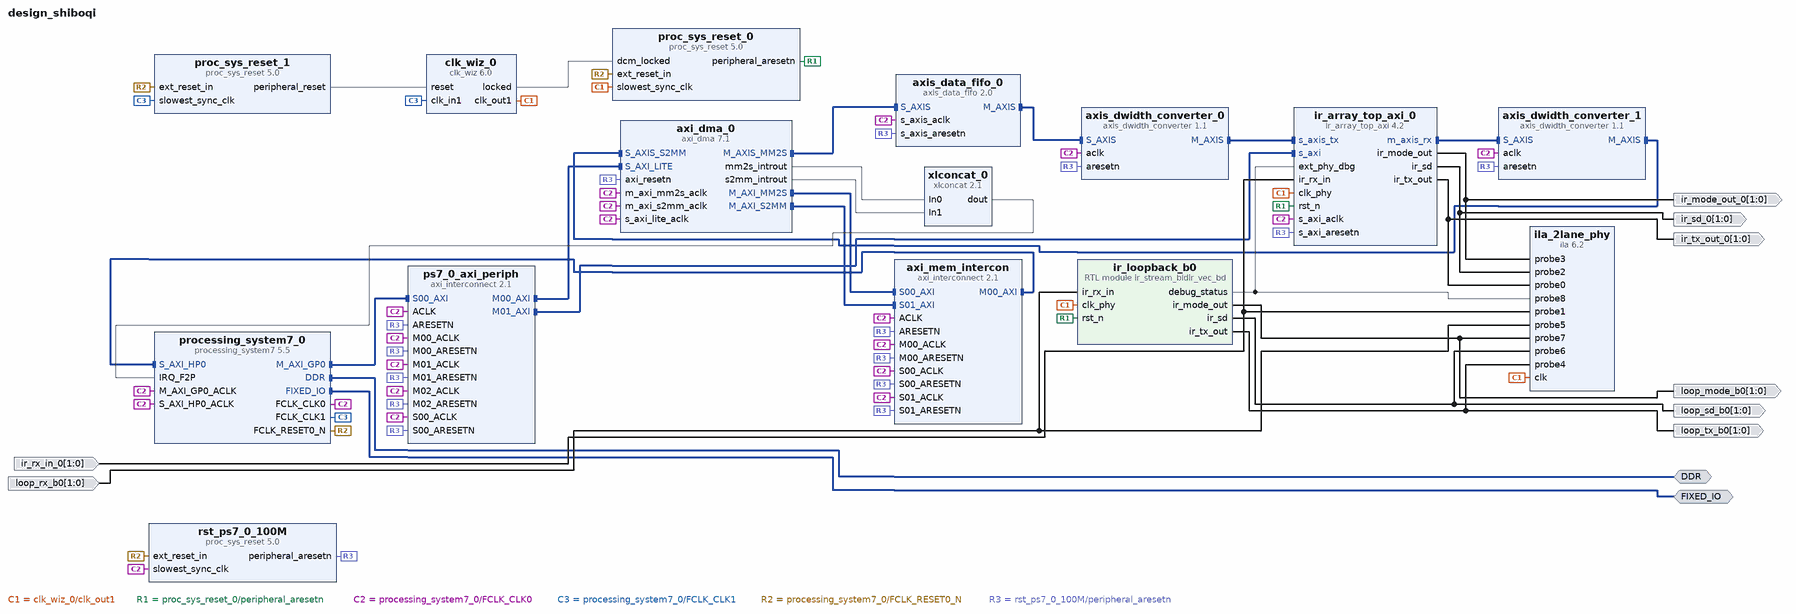
[diagram p0: block diagram of the top level]
# Vivado block design design_shiboqi, xc7z010clg400-1, Vivado 2023.1
create_bd_design design_shiboqi

create_bd_intf_port -mode Master -vlnv xilinx.com:interface:ddrx_rtl:1.0 DDR
create_bd_intf_port -mode Master -vlnv xilinx.com:display_processing_system7:fixedio_rtl:1.0 FIXED_IO
create_bd_port -dir I -from 1 -to 0 ir_rx_in_0
create_bd_port -dir O -from 1 -to 0 ir_sd_0
create_bd_port -dir O -from 1 -to 0 ir_mode_out_0
create_bd_port -dir O -from 1 -to 0 ir_tx_out_0
create_bd_port -dir I -from 1 -to 0 loop_rx_b0
create_bd_port -dir O -from 1 -to 0 loop_sd_b0
create_bd_port -dir O -from 1 -to 0 loop_mode_b0
create_bd_port -dir O -from 1 -to 0 loop_tx_b0

create_bd_cell -type ip -vlnv xilinx.com:ip:axi_dma:7.1 axi_dma_0
set_property -dict {CONFIG.c_include_sg 0} [get_bd_cells axi_dma_0]
create_bd_cell -type ip -vlnv xilinx.com:ip:axi_interconnect:2.1 axi_mem_intercon
set_property -dict {CONFIG.NUM_MI 1 CONFIG.NUM_SI 2} [get_bd_cells axi_mem_intercon]
create_bd_cell -type ip -vlnv xilinx.com:ip:axis_data_fifo:2.0 axis_data_fifo_0
set_property -dict [list \
  CONFIG.FIFO_DEPTH 1024 \
  CONFIG.HAS_RD_DATA_COUNT 1 \
  CONFIG.HAS_TKEEP 1 \
  CONFIG.HAS_TLAST 1 \
  CONFIG.HAS_WR_DATA_COUNT 1 \
  CONFIG.TDATA_NUM_BYTES 4 \
] [get_bd_cells axis_data_fifo_0]
create_bd_cell -type ip -vlnv xilinx.com:ip:axis_dwidth_converter:1.1 axis_dwidth_converter_0
set_property -dict [list \
  CONFIG.HAS_TLAST 1 \
  CONFIG.M_TDATA_NUM_BYTES 1 \
  CONFIG.S_TDATA_NUM_BYTES 4 \
] [get_bd_cells axis_dwidth_converter_0]
create_bd_cell -type ip -vlnv xilinx.com:ip:axis_dwidth_converter:1.1 axis_dwidth_converter_1
set_property -dict {CONFIG.M_TDATA_NUM_BYTES 4 CONFIG.S_TDATA_NUM_BYTES 1} [get_bd_cells axis_dwidth_converter_1]
create_bd_cell -type ip -vlnv xilinx.com:ip:clk_wiz:6.0 clk_wiz_0
set_property -dict [list \
  CONFIG.CLKOUT1_JITTER 180.197 \
  CONFIG.CLKOUT1_REQUESTED_OUT_FREQ 64 \
  CONFIG.MMCM_CLKOUT0_DIVIDE_F 15.625 \
  CONFIG.PRIM_SOURCE Global_buffer \
] [get_bd_cells clk_wiz_0]
create_bd_cell -type ip -vlnv xilinx.com:ip:proc_sys_reset:5.0 proc_sys_reset_0
create_bd_cell -type ip -vlnv xilinx.com:ip:proc_sys_reset:5.0 proc_sys_reset_1
create_bd_cell -type ip -vlnv xilinx.com:ip:processing_system7:5.5 processing_system7_0
set_property -dict [list \
  CONFIG.PCW_APU_PERIPHERAL_FREQMHZ 666.666666 \
  CONFIG.PCW_ENET0_ENET0_IO {MIO 16 .. 27} \
  CONFIG.PCW_ENET0_GRP_MDIO_ENABLE 1 \
  CONFIG.PCW_ENET0_GRP_MDIO_IO {MIO 52 .. 53} \
  CONFIG.PCW_ENET0_PERIPHERAL_ENABLE 1 \
  CONFIG.PCW_ENET0_RESET_ENABLE 0 \
  CONFIG.PCW_ENET_RESET_ENABLE 1 \
  CONFIG.PCW_ENET_RESET_SELECT {Share reset pin} \
  CONFIG.PCW_EN_CLK1_PORT 1 \
  CONFIG.PCW_FCLK_CLK1_BUF TRUE \
  CONFIG.PCW_FPGA0_PERIPHERAL_FREQMHZ 100 \
  CONFIG.PCW_FPGA1_PERIPHERAL_FREQMHZ 50 \
  CONFIG.PCW_FPGA_FCLK1_ENABLE 1 \
  CONFIG.PCW_GPIO_MIO_GPIO_ENABLE 1 \
  CONFIG.PCW_GPIO_MIO_GPIO_IO MIO \
  CONFIG.PCW_I2C_RESET_ENABLE 1 \
  CONFIG.PCW_IRQ_F2P_INTR 1 \
  CONFIG.PCW_PERIPHERAL_BOARD_PRESET None \
  CONFIG.PCW_PRESET_BANK1_VOLTAGE {LVCMOS 1.8V} \
  CONFIG.PCW_QSPI_GRP_SINGLE_SS_ENABLE 1 \
  CONFIG.PCW_QSPI_GRP_SINGLE_SS_IO {MIO 1 .. 6} \
  CONFIG.PCW_QSPI_PERIPHERAL_ENABLE 1 \
  CONFIG.PCW_QSPI_QSPI_IO {MIO 1 .. 6} \
  CONFIG.PCW_SD0_GRP_CD_ENABLE 1 \
  CONFIG.PCW_SD0_GRP_CD_IO {MIO 47} \
  CONFIG.PCW_SD0_GRP_WP_ENABLE 0 \
  CONFIG.PCW_SD0_PERIPHERAL_ENABLE 1 \
  CONFIG.PCW_SD0_SD0_IO {MIO 40 .. 45} \
  CONFIG.PCW_SDIO_PERIPHERAL_FREQMHZ 100 \
  CONFIG.PCW_SINGLE_QSPI_DATA_MODE x4 \
  CONFIG.PCW_UART1_PERIPHERAL_ENABLE 1 \
  CONFIG.PCW_UART1_UART1_IO {MIO 48 .. 49} \
  CONFIG.PCW_UART_PERIPHERAL_FREQMHZ 100 \
  CONFIG.PCW_UIPARAM_DDR_FREQ_MHZ 533.333333 \
  CONFIG.PCW_UIPARAM_DDR_PARTNO {MT41J128M16 HA-125} \
  CONFIG.PCW_USB0_PERIPHERAL_ENABLE 1 \
  CONFIG.PCW_USB0_RESET_ENABLE 1 \
  CONFIG.PCW_USB0_RESET_IO {MIO 46} \
  CONFIG.PCW_USB0_USB0_IO {MIO 28 .. 39} \
  CONFIG.PCW_USB_RESET_ENABLE 1 \
  CONFIG.PCW_USB_RESET_SELECT {Share reset pin} \
  CONFIG.PCW_USE_FABRIC_INTERRUPT 1 \
  CONFIG.PCW_USE_S_AXI_HP0 1 \
  CONFIG.preset None \
] [get_bd_cells processing_system7_0]
# 513 more settings of processing_system7_0 are not shown: defaults, MIO pin electricals, DDR timing, and values the tool derives
create_bd_cell -type ip -vlnv xilinx.com:ip:axi_interconnect:2.1 ps7_0_axi_periph
set_property -dict {CONFIG.NUM_MI 3} [get_bd_cells ps7_0_axi_periph]
create_bd_cell -type ip -vlnv xilinx.com:ip:proc_sys_reset:5.0 rst_ps7_0_100M
create_bd_cell -type ip -vlnv xilinx.com:ip:xlconcat:2.1 xlconcat_0
create_bd_cell -type ip -vlnv xilinx.com:user:ir_array_top_axi:4.2 ir_array_top_axi_0
set_property -dict [list \
  CONFIG.CNT_CHIP_MAX 7 \
  CONFIG.CNT_PREAMBLE 64 \
  CONFIG.FORCE_SD_SHUTDOWN 0 \
  CONFIG.FRAGMENT_BYTES 252 \
  CONFIG.FRAG_TIMEOUT_CYCLES 50000 \
  CONFIG.LANE_COUNT 2 \
  CONFIG.MAX_FRAGS 1 \
  CONFIG.MAX_FRAME_BYTES 266 \
  CONFIG.MAX_PACKET_BYTES 252 \
  CONFIG.MAX_RETRY 4 \
  CONFIG.PARALLEL_2LANE_MODE 0 \
  CONFIG.RX_ASYNC_FIFO_DEPTH 1024 \
  CONFIG.RX_DATA_PHASE_DELAY_CYCLES 0 \
  CONFIG.RX_DETECT_END_CYCLES 7 \
  CONFIG.RX_DETECT_START_CYCLES 3 \
  CONFIG.RX_PREAMBLE_REALIGN_EDGE 1 \
  CONFIG.RX_TO_TX_GUARD_CYCLES 4096 \
  CONFIG.STREAM_FULL_MODE 1 \
  CONFIG.STREAM_NODE_ID 0 \
  CONFIG.STREAM_PHY_DBG_SELECT 0 \
  CONFIG.TX_ASYNC_FIFO_DEPTH 1024 \
  CONFIG.TX_ONLY_ACK_MODE 0 \
  CONFIG.TX_POST_ACK_GUARD_CYCLES 4096 \
] [get_bd_cells ir_array_top_axi_0]
create_bd_cell -type module -reference ir_stream_bidir_vec_bd ir_loopback_b0
set_property -dict [list \
  CONFIG.APP_PAYLOAD_BYTES 244 \
  CONFIG.B2A_ECHO_ENABLE 0 \
  CONFIG.B2A_ENABLE 1 \
  CONFIG.B2A_FREE_RUN 1 \
  CONFIG.B_ACK_LANE_MASK 1 \
  CONFIG.B_BACKOFF_SLOT_CYCLES 1024 \
  CONFIG.B_CNT_CHIP_MAX 7 \
  CONFIG.B_CNT_PREAMBLE 64 \
  CONFIG.B_DEBUG_SELECT_RX_STATUS 0 \
  CONFIG.B_EXPECTED_A_LANE_MASK 1 \
  CONFIG.B_GUARD_CYCLES 4096 \
  CONFIG.B_PARALLEL_2LANE_MODE 0 \
  CONFIG.B_RECOVERY_RESET_CYCLES 2048 \
  CONFIG.B_RX_DATA_PHASE_DELAY_CYCLES 0 \
  CONFIG.B_RX_DETECT_END_CYCLES 7 \
  CONFIG.B_RX_DETECT_START_CYCLES 3 \
  CONFIG.B_RX_LANE_MASK 1 \
  CONFIG.B_RX_PREAMBLE_REALIGN_EDGE 1 \
  CONFIG.B_SESSION_ID 0x2201 \
  CONFIG.B_START_IDLE_CYCLES 100000 \
  CONFIG.B_TX_LANE_MASK 1 \
  CONFIG.FORCE_SD_SHUTDOWN 0 \
  CONFIG.FRAGMENT_BYTES 252 \
  CONFIG.LANE_COUNT 2 \
  CONFIG.RAW_PACKET_BYTES 252 \
  CONFIG.TX_GAP_CYCLES 150000 \
] [get_bd_cells ir_loopback_b0]
create_bd_cell -type ip -vlnv xilinx.com:ip:ila:6.2 ila_2lane_phy
set_property -dict [list \
  CONFIG.C_ADV_TRIGGER false \
  CONFIG.C_DATA_DEPTH 16384 \
  CONFIG.C_EN_STRG_QUAL 0 \
  CONFIG.C_INPUT_PIPE_STAGES 0 \
  CONFIG.C_MONITOR_TYPE Native \
  CONFIG.C_NUM_OF_PROBES 9 \
  CONFIG.C_PROBE0_WIDTH 2 \
  CONFIG.C_PROBE1_WIDTH 2 \
  CONFIG.C_PROBE2_WIDTH 2 \
  CONFIG.C_PROBE3_WIDTH 2 \
  CONFIG.C_PROBE4_WIDTH 2 \
  CONFIG.C_PROBE5_WIDTH 2 \
  CONFIG.C_PROBE6_WIDTH 2 \
  CONFIG.C_PROBE7_WIDTH 2 \
  CONFIG.C_PROBE8_WIDTH 32 \
  CONFIG.C_TRIGIN_EN false \
  CONFIG.C_TRIGOUT_EN false \
] [get_bd_cells ila_2lane_phy]

# ---- connections ----

connect_bd_intf_net [get_bd_intf_pins axi_dma_0/M_AXIS_MM2S] [get_bd_intf_pins axis_data_fifo_0/S_AXIS]
connect_bd_intf_net [get_bd_intf_pins axi_dma_0/M_AXI_MM2S] [get_bd_intf_pins axi_mem_intercon/S00_AXI]
connect_bd_intf_net [get_bd_intf_pins axi_dma_0/M_AXI_S2MM] [get_bd_intf_pins axi_mem_intercon/S01_AXI]
connect_bd_intf_net [get_bd_intf_pins axi_mem_intercon/M00_AXI] [get_bd_intf_pins processing_system7_0/S_AXI_HP0]
connect_bd_intf_net [get_bd_intf_pins axis_data_fifo_0/M_AXIS] [get_bd_intf_pins axis_dwidth_converter_0/S_AXIS]
connect_bd_intf_net [get_bd_intf_pins ir_array_top_axi_0/s_axis_tx] [get_bd_intf_pins axis_dwidth_converter_0/M_AXIS]
connect_bd_intf_net [get_bd_intf_pins axis_dwidth_converter_1/M_AXIS] [get_bd_intf_pins axi_dma_0/S_AXIS_S2MM]
connect_bd_intf_net [get_bd_intf_pins ir_array_top_axi_0/m_axis_rx] [get_bd_intf_pins axis_dwidth_converter_1/S_AXIS]
connect_bd_intf_net [get_bd_intf_ports DDR] [get_bd_intf_pins processing_system7_0/DDR]
connect_bd_intf_net [get_bd_intf_ports FIXED_IO] [get_bd_intf_pins processing_system7_0/FIXED_IO]
connect_bd_intf_net [get_bd_intf_pins processing_system7_0/M_AXI_GP0] [get_bd_intf_pins ps7_0_axi_periph/S00_AXI]
connect_bd_intf_net [get_bd_intf_pins ps7_0_axi_periph/M00_AXI] [get_bd_intf_pins axi_dma_0/S_AXI_LITE]
connect_bd_intf_net [get_bd_intf_pins ir_array_top_axi_0/s_axi] [get_bd_intf_pins ps7_0_axi_periph/M01_AXI]
connect_bd_net [get_bd_pins axi_dma_0/mm2s_introut] [get_bd_pins xlconcat_0/In0]
connect_bd_net [get_bd_pins axi_dma_0/s2mm_introut] [get_bd_pins xlconcat_0/In1]
connect_bd_net [get_bd_pins clk_wiz_0/clk_out1] \
  [get_bd_pins proc_sys_reset_0/slowest_sync_clk] [get_bd_pins ir_array_top_axi_0/clk_phy] \
  [get_bd_pins ir_loopback_b0/clk_phy] [get_bd_pins ila_2lane_phy/clk]
connect_bd_net [get_bd_pins clk_wiz_0/locked] [get_bd_pins proc_sys_reset_0/dcm_locked]
connect_bd_net [get_bd_pins ir_array_top_axi_0/ir_mode_out] [get_bd_ports ir_mode_out_0] [get_bd_pins ila_2lane_phy/probe3]
connect_bd_net [get_bd_pins ir_array_top_axi_0/ir_sd] [get_bd_ports ir_sd_0] [get_bd_pins ila_2lane_phy/probe2]
connect_bd_net [get_bd_pins ir_array_top_axi_0/ir_tx_out] [get_bd_ports ir_tx_out_0] [get_bd_pins ila_2lane_phy/probe0]
connect_bd_net [get_bd_pins ir_loopback_b0/debug_status] [get_bd_pins ir_array_top_axi_0/ext_phy_dbg] [get_bd_pins ila_2lane_phy/probe8]
connect_bd_net [get_bd_pins ir_loopback_b0/ir_mode_out] [get_bd_ports loop_mode_b0] [get_bd_pins ila_2lane_phy/probe7]
connect_bd_net [get_bd_pins ir_loopback_b0/ir_sd] [get_bd_ports loop_sd_b0] [get_bd_pins ila_2lane_phy/probe6]
connect_bd_net [get_bd_pins ir_loopback_b0/ir_tx_out] [get_bd_ports loop_tx_b0] [get_bd_pins ila_2lane_phy/probe4]
connect_bd_net -net ir_rx_in_0_1 [get_bd_ports ir_rx_in_0] [get_bd_pins ir_array_top_axi_0/ir_rx_in] [get_bd_pins ila_2lane_phy/probe1]
connect_bd_net -net loop_rx_b0_1 [get_bd_ports loop_rx_b0] [get_bd_pins ir_loopback_b0/ir_rx_in] [get_bd_pins ila_2lane_phy/probe5]
connect_bd_net [get_bd_pins proc_sys_reset_0/peripheral_aresetn] [get_bd_pins ir_array_top_axi_0/rst_n] [get_bd_pins ir_loopback_b0/rst_n]
connect_bd_net [get_bd_pins proc_sys_reset_1/peripheral_reset] [get_bd_pins clk_wiz_0/reset]
connect_bd_net [get_bd_pins processing_system7_0/FCLK_CLK0] \
  [get_bd_pins processing_system7_0/M_AXI_GP0_ACLK] [get_bd_pins ps7_0_axi_periph/S00_ACLK] \
  [get_bd_pins rst_ps7_0_100M/slowest_sync_clk] [get_bd_pins axi_dma_0/s_axi_lite_aclk] \
  [get_bd_pins ps7_0_axi_periph/M00_ACLK] [get_bd_pins ps7_0_axi_periph/ACLK] [get_bd_pins axi_dma_0/m_axi_mm2s_aclk] \
  [get_bd_pins axi_mem_intercon/S00_ACLK] [get_bd_pins processing_system7_0/S_AXI_HP0_ACLK] \
  [get_bd_pins axi_mem_intercon/M00_ACLK] [get_bd_pins axi_mem_intercon/ACLK] [get_bd_pins axi_dma_0/m_axi_s2mm_aclk] \
  [get_bd_pins axi_mem_intercon/S01_ACLK] [get_bd_pins axis_data_fifo_0/s_axis_aclk] \
  [get_bd_pins axis_dwidth_converter_0/aclk] [get_bd_pins ps7_0_axi_periph/M01_ACLK] [get_bd_pins ps7_0_axi_periph/M02_ACLK] \
  [get_bd_pins axis_dwidth_converter_1/aclk] [get_bd_pins ir_array_top_axi_0/s_axi_aclk]
connect_bd_net [get_bd_pins processing_system7_0/FCLK_CLK1] [get_bd_pins clk_wiz_0/clk_in1] [get_bd_pins proc_sys_reset_1/slowest_sync_clk]
connect_bd_net [get_bd_pins processing_system7_0/FCLK_RESET0_N] \
  [get_bd_pins rst_ps7_0_100M/ext_reset_in] [get_bd_pins proc_sys_reset_0/ext_reset_in] \
  [get_bd_pins proc_sys_reset_1/ext_reset_in]
connect_bd_net [get_bd_pins rst_ps7_0_100M/peripheral_aresetn] \
  [get_bd_pins ps7_0_axi_periph/S00_ARESETN] [get_bd_pins axi_dma_0/axi_resetn] [get_bd_pins ps7_0_axi_periph/M00_ARESETN] \
  [get_bd_pins ps7_0_axi_periph/ARESETN] [get_bd_pins axi_mem_intercon/S00_ARESETN] \
  [get_bd_pins axi_mem_intercon/M00_ARESETN] [get_bd_pins axi_mem_intercon/ARESETN] \
  [get_bd_pins axi_mem_intercon/S01_ARESETN] [get_bd_pins axis_data_fifo_0/s_axis_aresetn] \
  [get_bd_pins axis_dwidth_converter_0/aresetn] [get_bd_pins ps7_0_axi_periph/M01_ARESETN] \
  [get_bd_pins ps7_0_axi_periph/M02_ARESETN] [get_bd_pins axis_dwidth_converter_1/aresetn] \
  [get_bd_pins ir_array_top_axi_0/s_axi_aresetn]
connect_bd_net [get_bd_pins xlconcat_0/dout] [get_bd_pins processing_system7_0/IRQ_F2P]

# ---- address map ----
assign_bd_address -offset 0x00000000 -range 512M -target_address_space [get_bd_addr_spaces axi_dma_0/Data_MM2S] [get_bd_addr_segs processing_system7_0/S_AXI_HP0/HP0_DDR_LOWOCM]
assign_bd_address -offset 0x00000000 -range 512M -target_address_space [get_bd_addr_spaces axi_dma_0/Data_S2MM] [get_bd_addr_segs processing_system7_0/S_AXI_HP0/HP0_DDR_LOWOCM]
assign_bd_address -offset 0x40400000 -range 64K -target_address_space [get_bd_addr_spaces processing_system7_0/Data] [get_bd_addr_segs axi_dma_0/S_AXI_LITE/Reg]
assign_bd_address -offset 0x43C00000 -range 4K -target_address_space [get_bd_addr_spaces processing_system7_0/Data] [get_bd_addr_segs ir_array_top_axi_0/s_axi/reg0]

validate_bd_design
save_bd_design
